# Altium schematic sheet as5600-module.SchDoc
size 406 x 355 mm
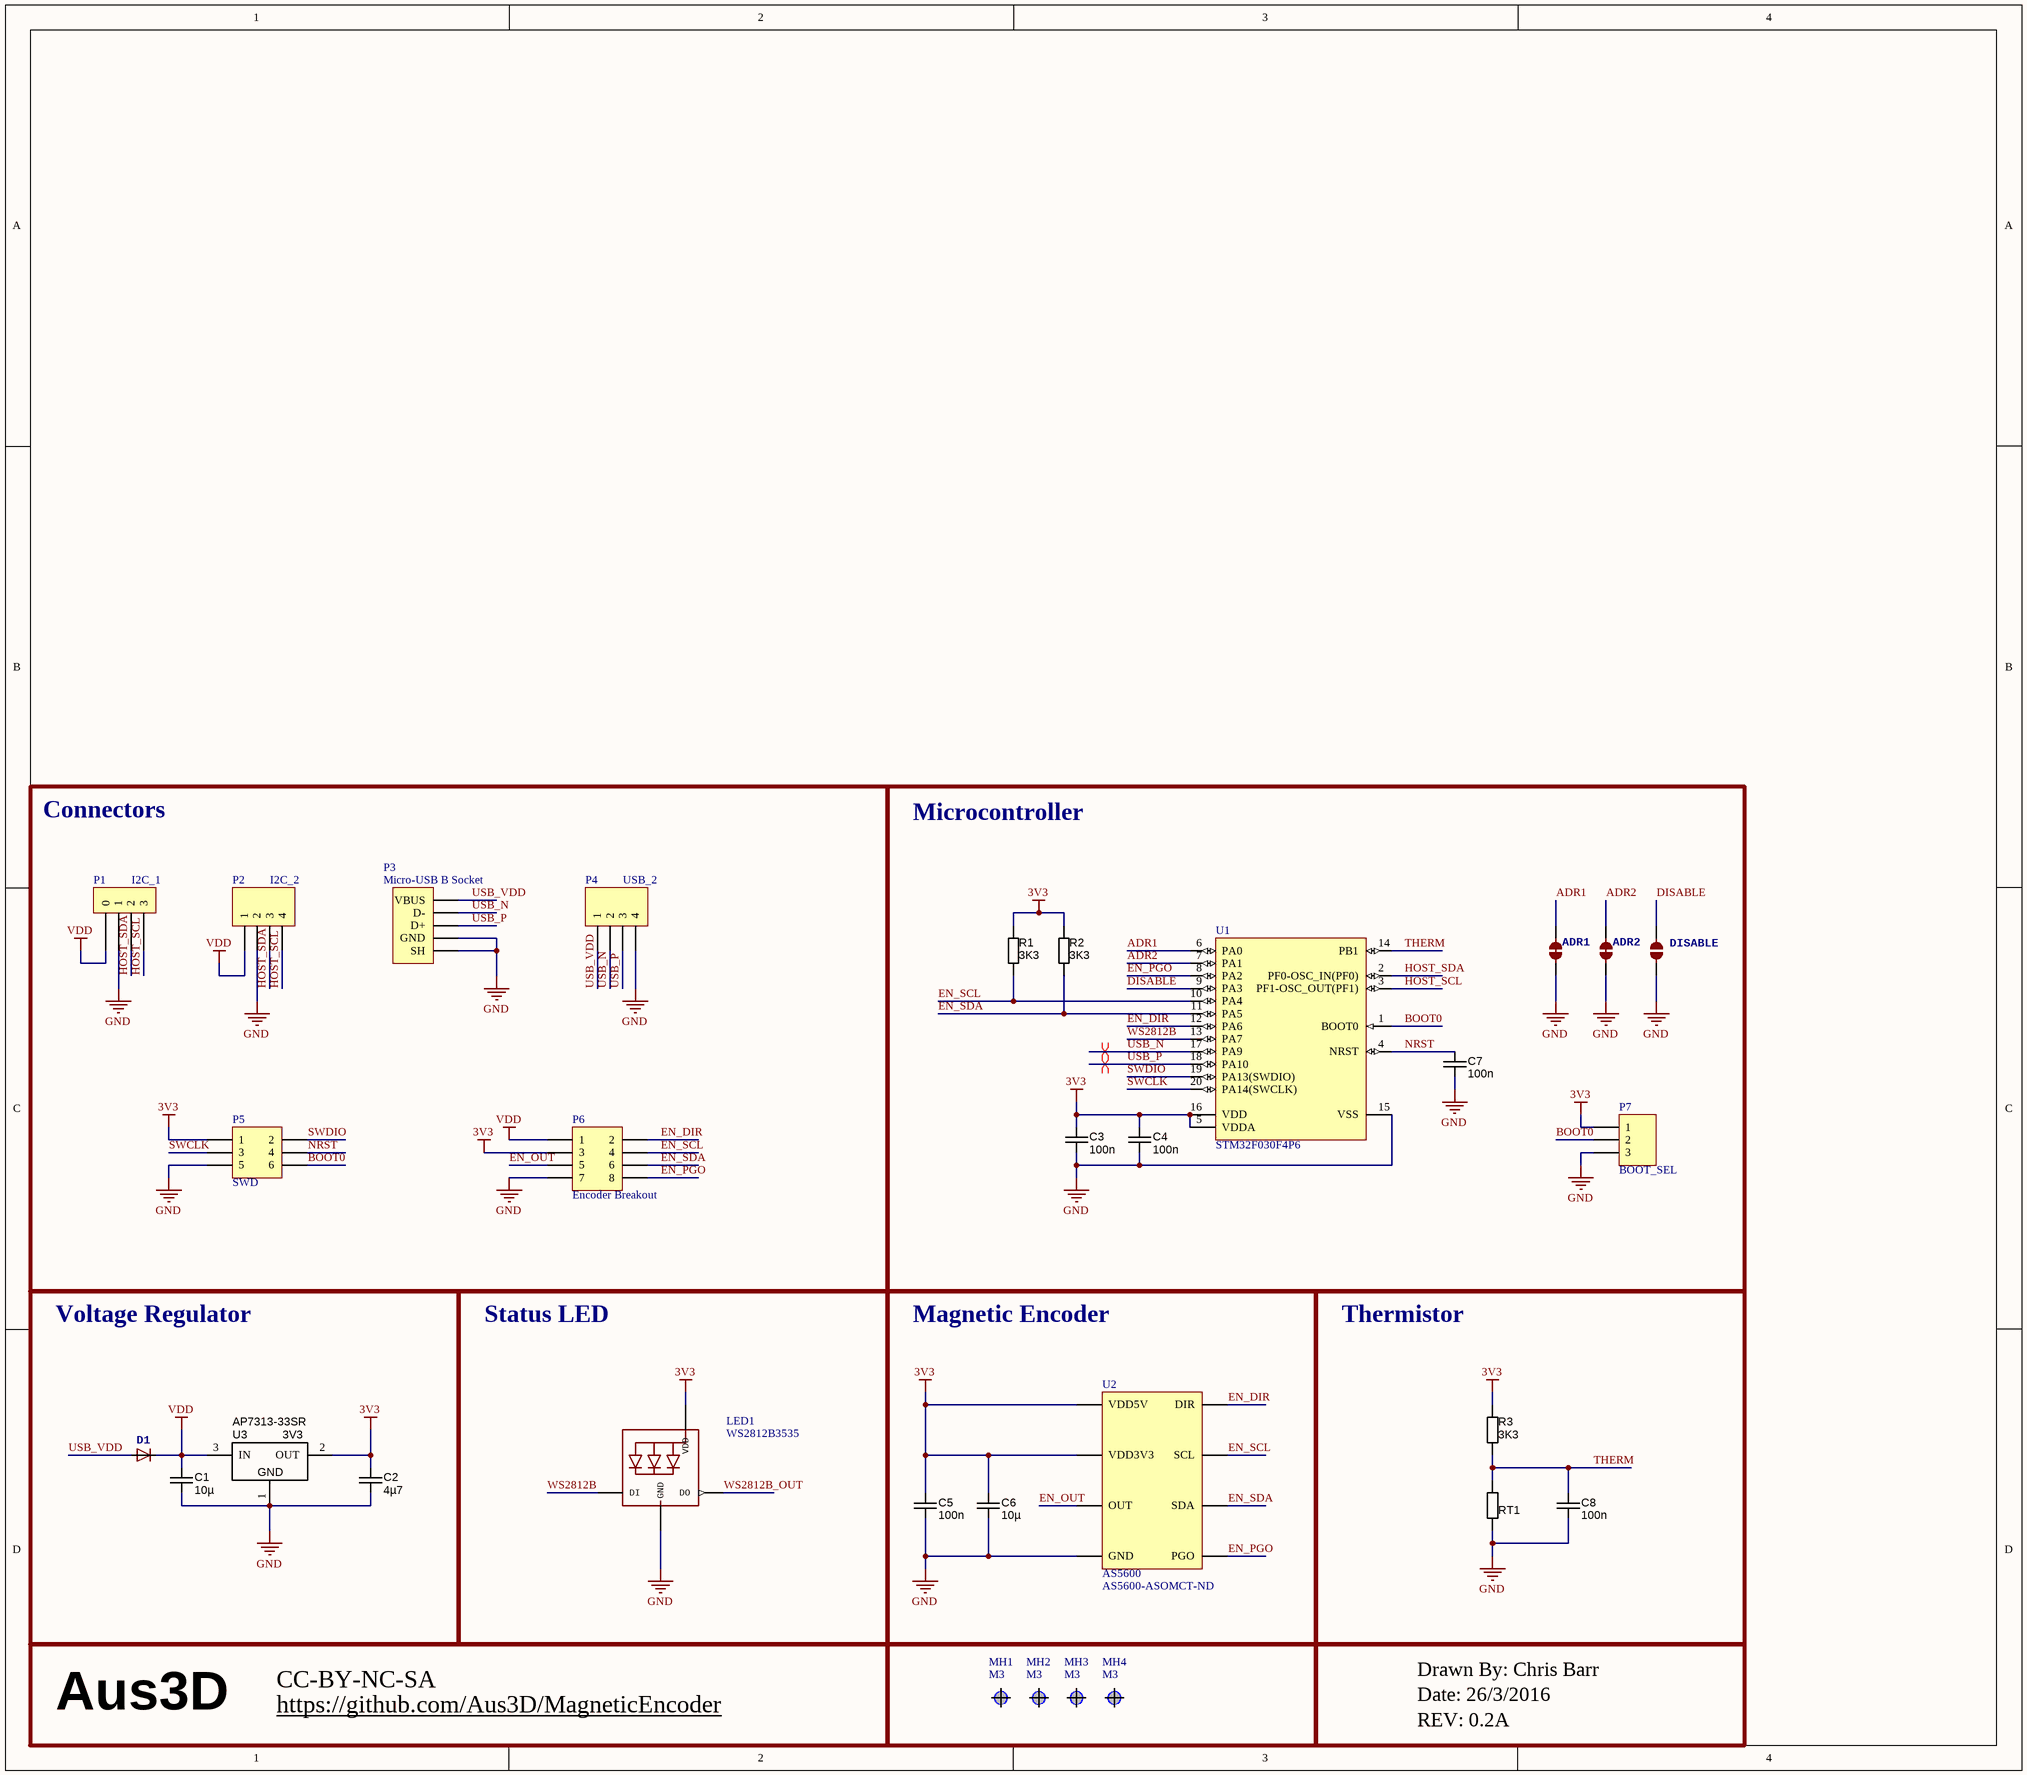
[diagram p0: as5600-module.SchDoc]

## Parts
ADR1  JUMPER-PAD-2-NC_BY_TRACE  [PAD-JUMPER-2-NC_BY_TRACE_YES_SILK]  (value not drawn)  (no BOM)
ADR2  JUMPER-PAD-2-NC_BY_TRACE  [PAD-JUMPER-2-NC_BY_TRACE_YES_SILK]  (value not drawn)  (no BOM)
C1  value 10µ  [CAPC2012X135N]  (hidden comment: approved sub OK)
C2  value 4µ7  [CAPC2012X135N]  (hidden comment: approved sub OK)
C3  value 100n  [CAPC2012X135N]  (hidden comment: approved sub OK)
C4  value 100n  [CAPC2012X135N]  (hidden comment: approved sub OK)
C5  value 100n  [CAPC2012X135N]  (hidden comment: approved sub OK)
C6  value 10µ  [CAPC2012X135N]  (hidden comment: approved sub OK)
C7  value 100n  [CAPC2012X135N]  (hidden comment: approved sub OK)
C8  value 100n  [CAPC2012X135N]  (hidden comment: approved sub OK)
D1  Diode   SMADIODE - SMA Surface Mount Package  20V 1A Schottky Diode Digikey: 641-1014-6-ND    DO-1N4148 - Through Hole Small Current Diode SOD-123 20V 1 A (.5mV Vf) Schottky Diode - Digikey: MBRX120TPMSCT-ND    SOD-323 10V 570mA (.38mV Vf, 3ns) Schottky Diode - Digikey: ZLLS410CT-ND    SOD-523 30V 30mA Schottky Diode (RB751S-40TE61) - Digikey: RB751S-40TE61CT-ND    SOT23-R/W - SOT23 Package (R = Solder Paste/Reflow Ovens, W = Hand-Soldering)  BAT54Film 40V 300mA - Digikey: 497-7162-1-ND  [SOT23-R]  (value not drawn)
DISABLE  JUMPER-PAD-2-NO  [PAD-JUMPER-2-NO_NO_SILK]  (value not drawn)  (no BOM)
LED1  WS2812B3535  [LED3535]
MH1  M3  [M3-Hole-3]
MH2  M3  [M3-Hole-3]
MH3  M3  [M3-Hole-3]
MH4  M3  [M3-Hole-3]
P1  I2C_1  [SM04B-SRSS-TB]
P2  I2C_2  [HDR1X4]  (no BOM)
P3  Micro-USB B Socket  [Micro-USB B Molex 105017-0001]
P4  USB_2  [HDR1X4]  (no BOM)
P5  SWD  [HDR2X3]  (no BOM)
P6  Encoder Breakout  [HDR2X4]  (no BOM)
P7  BOOT_SEL  [HDR1X3]
R1  value 3K3  [RESC2012X70N]  (hidden comment: Thick Film)
R2  value 3K3  [RESC2012X70N]  (hidden comment: Thick Film)
R3  value 3K3  [RESC2012X70N]  (hidden comment: Thick Film)
RT1  RES_EMPTY_0805  [RESC2012X70N]  (value not drawn)
U1  STM32F030F4P6  [STM-TSSOP20_N]
U2  AS5600  Supplier Part Number 1: AS5600-ASOMCT-ND  [AS5600 - SOIC127P600X175-8M]
U3  AP7313-33SR  value 3V3  [SOT23-3]

## Blocks framed on the sheet
Connectors: P1-P6
Microcontroller: ADR1 ADR2 C3 C4 C7 DISABLE P7 R1 R2 U1
Voltage Regulator: C1 C2 D1 U3
Status LED: LED1
Magnetic Encoder: C5 C6 U2
Thermistor: C8 R3 RT1

## Nets
3V3: C2.1 C3.1 C4.1 C5.1 C6.1 LED1.2(VDD) P5.1 P6.3 P7.1 R1.1 R2.1 R3.1 U1.5(VDDA) U1.16(VDD) U2.1(VDD5V) U2.2(VDD3V3) U3.2(OUT)
GND: ADR1.1 ADR2.1 C1.2 C2.2 C3.2 C4.2 C5.2 C6.2 C7.2 C8.2 DISABLE.2 LED1.4(GND) P1.1 P2.2 P3.GND P3.SHIELD(SH) P4.4 P5.5 P6.7 P7.3 RT1.1 U1.15(VSS) U2.4(GND) U3.1(GND)
VDD: C1.1 D1.3(C) P1.0 P2.1 P6.1 U3.3(IN)
ADR1: ADR1.2 U1.6(PA0)
ADR2: ADR2.2 U1.7(PA1)
BOOT0: P5.6 P7.2 U1.1(BOOT0)
DISABLE: DISABLE.1 U1.9(PA3)
EN_DIR: P6.2 U1.12(PA6) U2.8(DIR)
EN_OUT: P6.5 U2.3(OUT)
EN_PGO: P6.8 U1.8(PA2) U2.5(PGO)
EN_SCL: P6.4 R1.2 U1.10(PA4) U2.7(SCL)
EN_SDA: P6.6 R2.2 U1.11(PA5) U2.6(SDA)
HOST_SCL: P1.3 P2.4 U1.3(PF1-OSC_OUT(PF1))
HOST_SDA: P1.2 P2.3 U1.2(PF0-OSC_IN(PF0))
NRST: C7.1 P5.4 U1.4(NRST)
SWCLK: P5.3 U1.20(PA14(SWCLK))
SWDIO: P5.2 U1.19(PA13(SWDIO))
THERM: C8.1 R3.2 RT1.2 U1.14(PB1)
USB_N: P3.D- P4.2 U1.17(PA9)
USB_P: P3.D+ P4.3 U1.18(PA10)
USB_VDD: D1.1(A) P3.VBUS P4.1
WS2812B: LED1.1(DI) U1.13(PA7)
WS2812B_OUT: LED1.3(DO)

Not connected (* = marked no-connect by the designer): MH1 M3(0); MH2 M3(0); MH3 M3(0); MH4 M3(0)

## Layout directives
differential pair: USB_N, USB_P

## Notes on the sheet
- Aus3D
- https://github.com/Aus3D/MagneticEncoder
- CC-BY-NC-SA
- Drawn By: Chris Barr
- Date: 26/3/2016
- REV: 0.2A

## Library data of the parts
C1 C6 = CAPC_10u_0805_10V: Capacitor SMD Cer 10uF 10% 10V X5R 0805; Manufacturer 1: AVX Corporation; Manufacturer Part Number 1: 0805ZD106KAT2A; Ratings: 10V; X5R; Material: ceramic; SCDType: spec; Package / Case: 0805 (2012 metric); Tolerance: ±10%; Manufacturer 2: Kemet; Manufacturer Part Number 2: C0805C106K8PACTU; Supplier 1: Digi-Key; Supplier Part Number 1: 478-5167-1-ND; ComponentLink1URL: http://www.avx.com/docs/Catalogs/cx5r.pdf; ComponentLink1Description: http://www.avx.com/docs/Catalogs/cx5r.pdf; ComponentLink2URL: http://www.kemet.com/datasheets&C0805C106K8PACTU; ComponentLink2Description: http://www.kemet.com/datasheets&C0805C106K8PACTU; Supplier 2: Digi-Key; Supplier Part Number 2: 399-4925-1-ND
C2 = CAPC_4u7_0805: Capacitor SMD Cer 4.7uF 10% 16V X5R 0805; Manufacturer 1: Taiyo Yuden; Manufacturer Part Number 1: EMK212BJ475KG-T; Ratings: 16V; X5R; Material: ceramic; SCDType: spec; Package / Case: 0805 (2012 Metric); Tolerance: ±10%; Supplier 1: Digi-Key; Supplier Part Number 1: 587-1294-1-ND; Operating Temperature: -55°C ~ 85°C; Size / Dimension: 0.079" L x 0.049" W (2.00mm x 1.25mm); Thickness (Max): 0.053" (1.35mm); ComponentLink1URL: http://www.yuden.co.jp/productdata/catalog/en/mlcc01_e.pdf; ComponentLink1Description: http://www.yuden.co.jp/productdata/catalog/en/mlcc01_e.pdf; Supplier 2: Digi-Key; Supplier Part Number 2: 1276-1065-1-ND; Manufacturer 2: Samsung Electro-Mechanics America, Inc; Manufacturer Part Number 2: CL21A475KOFNNNE; RoHS 2: RoHS Compliant; ComponentLink2URL: http://www.samsungsem.com/servlet/FileDownload?type=spec&file=CL21A475KOFNNNE.pdf; ComponentLink2Description: http://www.samsungsem.com/servlet/FileDownload?type=spec&file=CL21A475KOFNNNE.pdf; Supplier 3: Digi-Key; Supplier Part Number 3: 399-8101-1-ND; Manufacturer 3: Kemet; Manufacturer Part Number 3: C0805C475K4PACTU; RoHS 3: RoHS Compliant; ComponentLink3URL: http://capacitoredge.kemet.com/capedge2/DataSheet?pn=C0805C475K4PACTU; ComponentLink3Description: http://capacitoredge.kemet.com/capedge2/DataSheet?pn=C0805C475K4PACTU; Supplier 4: Digi-Key; Supplier Part Number 4: 490-7215-1-ND; Manufacturer 4: Murata Electronics North America; Manufacturer Part Number 4: GRM21BR61C475MA88L; RoHS 4: RoHS Compliant; ComponentLink4URL: http://psearch.murata.com/capacitor/product/GRM21BR61C475MA88#.pdf; ComponentLink4Description: http://psearch.murata.com/capacitor/product/GRM21BR61C475MA88#.pdf; Supplier 5: Digi-Key; Supplier Part Number 5: 445-7640-1-ND; Manufacturer 5: TDK Corporation; Manufacturer Part Number 5: C2012X5R1C475K125AC; RoHS 5: RoHS Compliant; ComponentLink5URL: http://product.tdk.com/capacitor/mlcc/en/documents/mlcc_commercial_general_en.pdf; ComponentLink5Description: http://product.tdk.com/capacitor/mlcc/en/documents/mlcc_commercial_general_en.pdf; RoHS 1: RoHS Compliant
C3-C5 C7 C8 = CAPC_100n_0805_X7R_50V_10%: Capacitor SMD Cer 100nF 10% 50V X7R 0805; Manufacturer 1: Kemet; Manufacturer Part Number 1: C0805C104K5RACTU; Ratings: 50V; X7R; Material: ceramic; SCDType: undef; Package / Case: 0805 (2012 metric); Tolerance: ±10%; Supplier 1: Digi-Key; Supplier Part Number 1: 399-1170-1-ND
D1 = DIODESOT23_REFLOW
LED1 = WS2812B3535: Manufacturer 1: DONGGUANG OPSCO OPTOELECTRONICS CO., LTD; Manufacturer Part Number 1: SK6812MINI
MH1-MH4 = Screw Hole
P1 = SM04B-SRSS-TB: Supplier 1: Digi-Key; Supplier Part Number 1: 455-1804-1-ND
P2 P4 = Header 4: Header, 4-Pin; LatestRevisionDate: 17-Jul-2002; LatestRevisionNote: Re-released for DXP Platform.; Publisher: Altium Limited
P5 = Header 3X2: Header, 3-Pin, Dual row; LatestRevisionDate: 17-Jul-2002; LatestRevisionNote: Re-released for DXP Platform.; Publisher: Altium Limited
P6 = Header 4X2: Header, 4-Pin, Dual row; LatestRevisionDate: 17-Jul-2002; LatestRevisionNote: Re-released for DXP Platform.; Publisher: Altium Limited
P7 = Header 3: Header, 3-Pin; LatestRevisionDate: 17-Jul-2002; LatestRevisionNote: Re-released for DXP Platform.; Publisher: Altium Limited
R1-R3 = RES_3K3_0805_1%: Resistor SMD chip 3.3k Ohm 0.125W 1% 0805; Manufacturer 1: Vishay/Dale; Manufacturer Part Number 1: CRCW08053K30FKEA; Ratings: 1/8W; SCDType: spec; Package / Case: 0805 (2012 metric); Supplier 1: Digi-Key; Supplier Part Number 1: 541-3.30KCCT-ND; Tolerance: ±1%
RT1 = RES_EMPTY_0805: Resistor, 0805 SMD, Empty footprint; Value: N/A; Package / Case: 0805 (2012 metric)
U1 = STM32F030F4P6: ARM Cortex-M0 32-bit MCU, 16 KB Flash, 4 KB Internal RAM, 15 I/Os, 20-pin TSSOP, -40 to 85 degC, Tube; FLASH Size (Prog) (kB): 16; I/Os (High Current): 15; Internal RAM Size (kB): 4; Operating Frequency(F) (Processor speed) (MHz): 48; Supply Voltage(Vcc) min (V): 2.4; DatasheetVersion: Rev. 1; PackageVersion: Rev. 1, 11/2012; PackageReference: TSSOP20; PackageDescription: 20-Pin Thin Shrink Small Outline Package, 6.5 x 4.4 mm Body, 0.65 mm Pitch; Supplier 1: Digi-Key; Supplier Part Number 1: 497-14044-5-ND; Supplier 2: Newark; Supplier Part Number 2: 06X3648; Supplier 3: Mouser; Supplier Part Number 3: 511-STM32F030F4P6; Core: ARM Cortex-M0; Packing: Tube; Mounting Technology: Surface Mount; PartNumber: STM32F030F4P6; ComponentLink1Description: Manufacturer URL; ComponentLink1URL: http://www.st.com/web/en/home.html; ComponentLink2Description: Datasheet; ComponentLink2URL: http://www.st.com/st-web-ui/static/active/en/resource/technical/document/datasheet/DM00088500.pdf; ComponentLink3Description: Package Specification; ComponentLink3URL: http://www.st.com/st-web-ui/static/active/en/resource/technical/document/datasheet/DM00065136.pdf
U2 = AMS AS5600: Supplier 1: Digi-Key
U3 = VREG_3V3_AP7313-33SR: Voltage Regulator 3.3V LDO SOT23R-3 SMD; Manufacturer 1: Diodes Inc; Manufacturer Part Number 1: AP7313-33SRG-7; Voltage Regulator Type: Low Drop-Out (LDO); Tolerance: ±2%; Ratings: 6Vin; 150mA; SCDType: source; Package / Case: SOT23R-3; Supplier 1: Digi-Key; Supplier Part Number 1: AP7313-33SRG-7DICT-ND; ComponentLink1URL: http://www.diodes.com/datasheets/AP7313.pdf; ComponentLink1Description: AP7313 datasheet
P3 = Micro-USB B Socket: Supplier 1: Digi-Key; Supplier Part Number 1: WM1399CT-ND